# EAGLE design Preliminary Schematic (EAGLE 9.5.1)
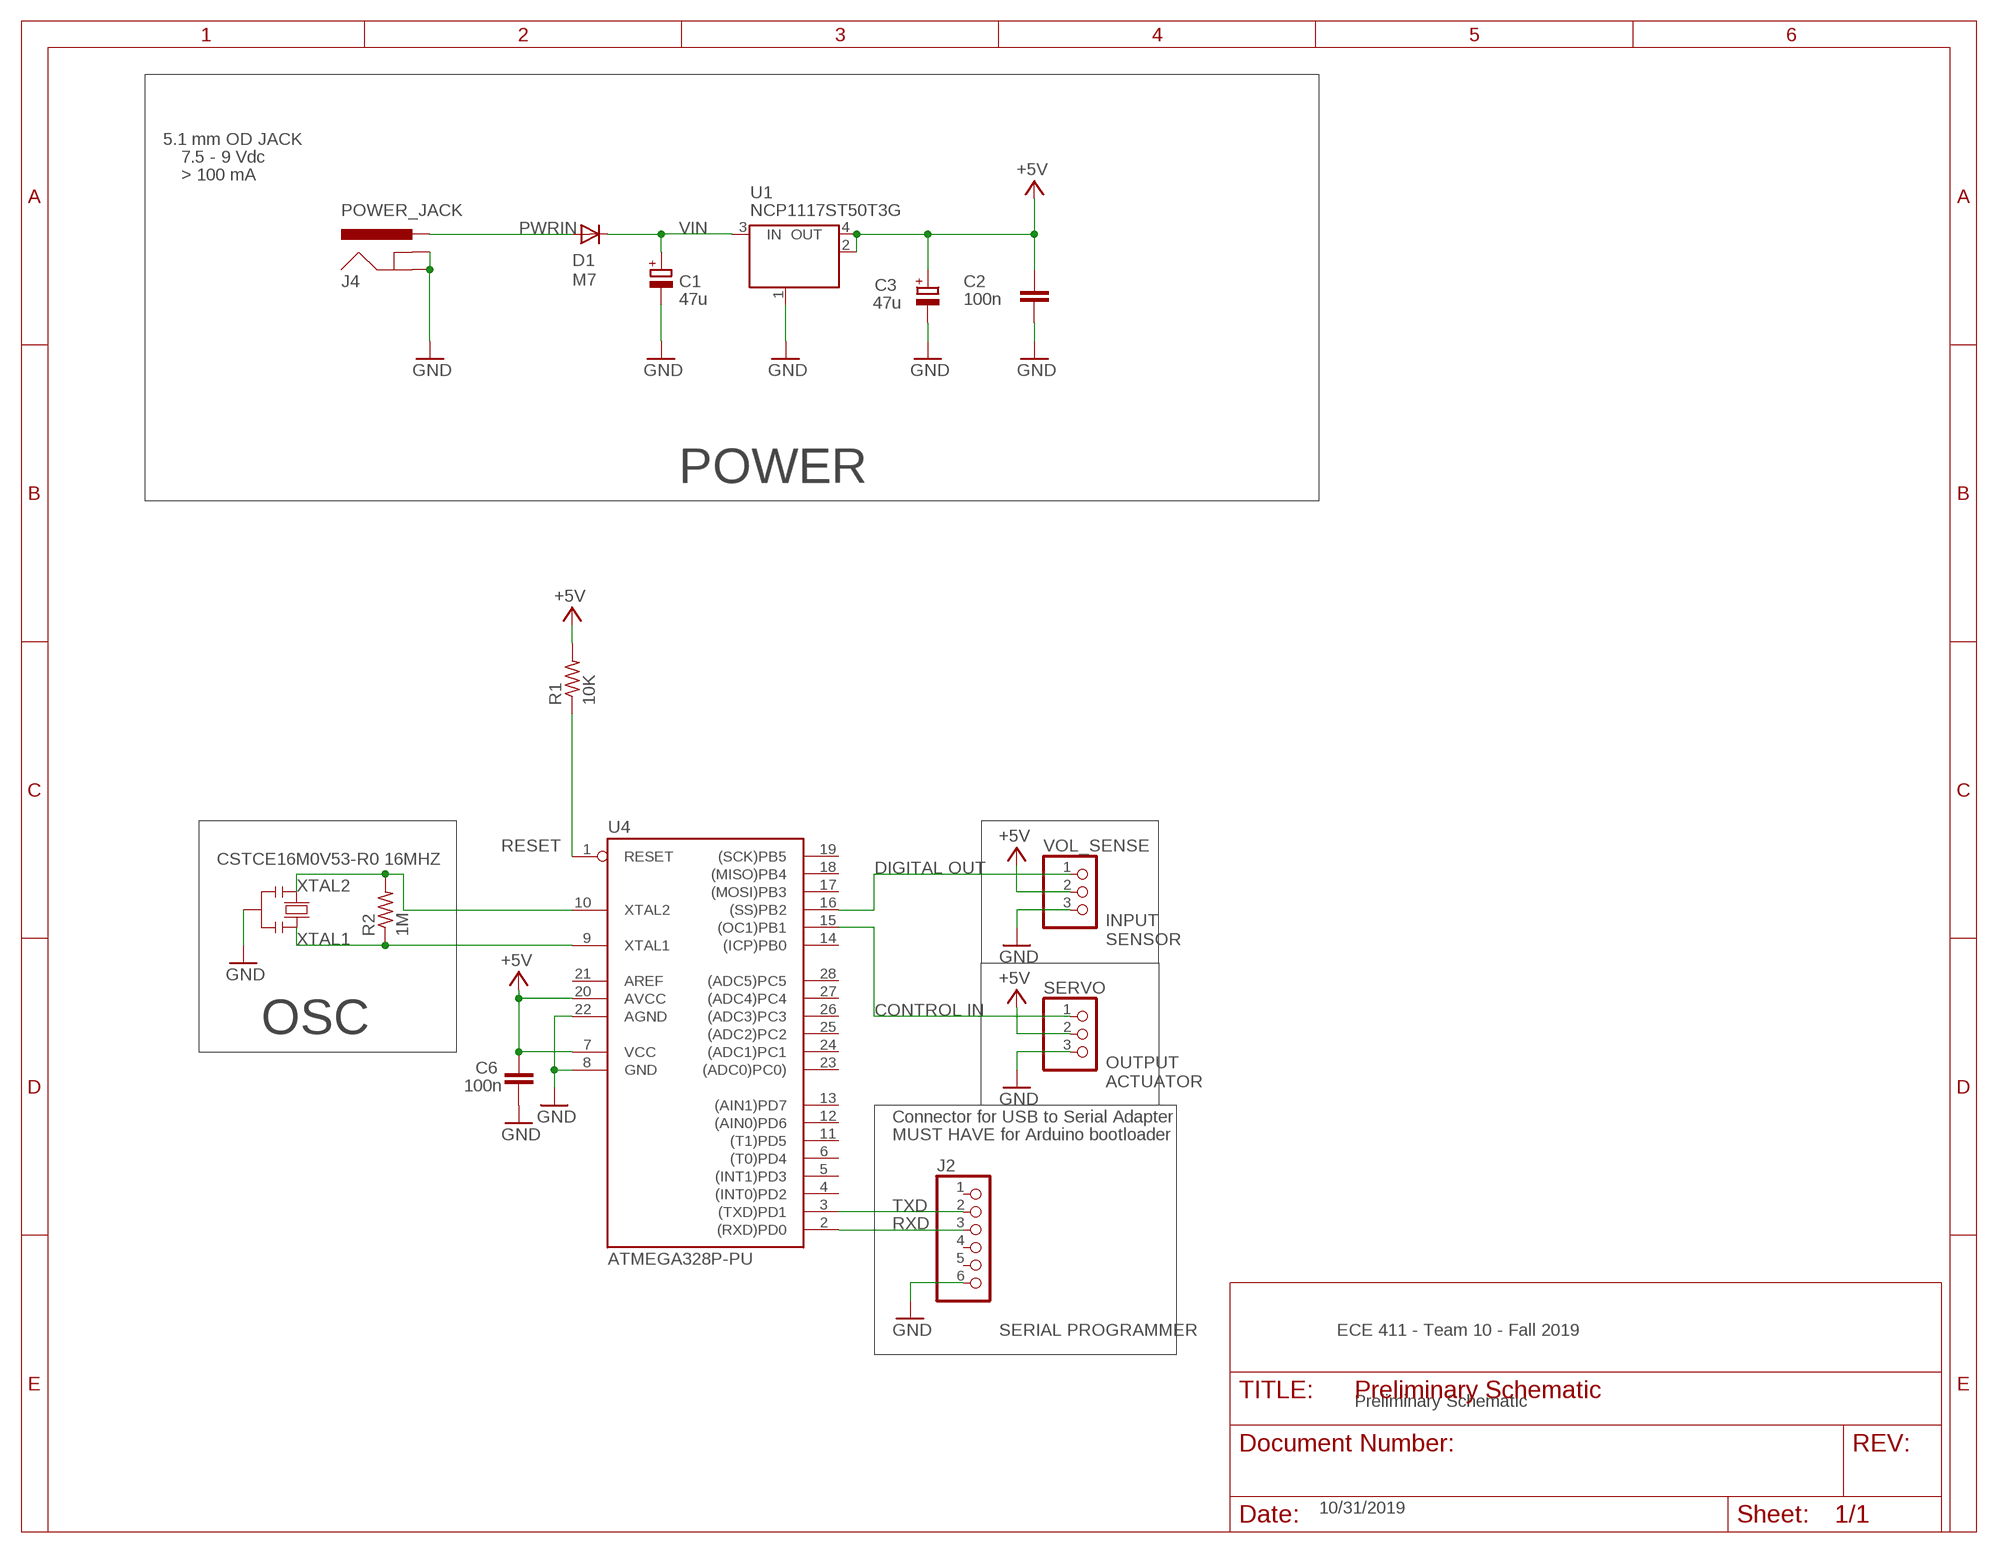
[diagram p0: schematic, sheet 1]

## Parts
C1  47u  CPOL-EUD  [PANASONIC_D]
C2  100n  C-EUC0805  [C0805]
C3  47u  CPOL-EUD  [PANASONIC_D]
C6  100n  C-EUC0805  [C0805]
D1  M7  DIODE-SMB  [SMB]
J2  PINHD-1X6  [1X06]
J4  POWER_JACK  [POWER_JACK_PTH]
R1  10K  R-US_R0805  [R0805]
R2  1M  R-US_R0805  [R0805]
SERVO  PINHD-1X3  [1X03]
U1  NCP1117ST50T3G  MC33269ST-3.3T3  [SOT223]
U4  ATMEGA328P-PU  [DIL28-3]
VOL_SENSE  PINHD-1X3  [1X03]
X1  CSTCE16M0V53-R0 16MHZ  RESONATORMU  [RESONATOR]

## Nets
+5V [usbvcc]: C2.2 C3.+ C6.2 R1.2 SERVO.2 U1.2(OUT) U1.4(OUT) U4.7(VCC) U4.20(AVCC) VOL_SENSE.2
GND [gnd]: C1.- C2.1 C3.- C6.1 J2.6 J4.GND J4.GNDBREAK SERVO.3 U1.1(GND/ADJ) U4.8(GND) U4.22(AGND) VOL_SENSE.3 X1.2
N$2: SERVO.1 U4.15((OC1)PB1)
N$3: U4.16((SS)PB2) VOL_SENSE.1
PWRIN [power]: D1.A J4.PWR
RESET: R1.1 U4.1(RESET)
RXD: J2.3 U4.2((RXD)PD0)
TXD: J2.2 U4.3((TXD)PD1)
VIN [power]: C1.+ D1.C U1.3(IN)
XTAL1: R2.1 U4.9(XTAL1) X1.3
XTAL2: R2.2 U4.10(XTAL2) X1.1
Unconnected: J2.1 J2.4 J2.5 U4.4((INT0)PD2) U4.5((INT1)PD3) U4.6((T0)PD4) U4.11((T1)PD5) U4.12((AIN0)PD6) U4.13((AIN1)PD7) U4.14((ICP)PB0) U4.17((MOSI)PB3) U4.18((MISO)PB4) U4.19((SCK)PB5) U4.21(AREF) U4.23((ADC0)PC0)) U4.24((ADC1)PC1) U4.25((ADC2)PC2) U4.26((ADC3)PC3) U4.27((ADC4)PC4) U4.28((ADC5)PC5)

## Notes on the sheet
- 5.1 mm OD JACK
- 7.5 - 9 Vdc
- > 100 mA
- POWER
- DIGITAL OUT
- INPUT 
  SENSOR
- CONTROL IN
- OSC
- OUTPUT
  ACTUATOR
- Connector for USB to Serial Adapter
- MUST HAVE for Arduino bootloader
- SERIAL PROGRAMMER | ECE 411 - Team 10 - Fall 2019
- Preliminary Schematic
- 10/31/2019

## Library data of the parts
C1 C3 = rcl:CPOL-EU: POLARIZED CAPACITOR, European symbol
C2 C6 = rcl:C-EU: CAPACITOR, European symbol
D1 = diode:DIODE-: DIODE
J2 = pinhead:PINHD-1X6: PIN HEADER
J4 = SparkFun-Connectors:POWER_JACK: Power Jack Connector This is the standard 5.5mm barrel jack for power. The PTH is the most common, proven, reliable, footprint. The Slot footprint only works if the mill layer is transmitted to the PCB fab house so be warned. Here are the connectors we sell at SparkFun: DC Barrel Power Jack/Connector <https://www.sparkfun.com/products/119> (PRT-00119) DC Barrel Power Jack/Connector (SMD) <https://www.sparkfun.com/products/12748> (PRT-12748) DC Barrel Jack Adapter - Breadboard Compatible <https://www.sparkfun.com/products/10811> (PRT-10811) It is used on this SparkFun product (and many, many others): SparkFun RedBoard - Programmed with Arduino <https://www.sparkfun.com/products/12757> (DEV-12757) Also, if you need a mating power supply or connector, please check these out: Wall Adapter Power Supply - 9VDC 650mA <https://www.sparkfun.com/products/298> (TOL-00298) DC Barrel Jack Adapter - Male <https://www.sparkfun.com/products/10287> (PRT-10287); PROD_ID: CONN-08197
R1 R2 = rcl:R-US_: RESISTOR, American symbol
SERVO VOL_SENSE = pinhead:PINHD-1X3: PIN HEADER
U1 = linear:MC33269ST*: Adjustable Output Low Dropout Voltage Regulator 800 mA Source: http://www.onsemi.com/pub/Collateral/MC33269-D.PDF
U4 = SmartPrj:ATMEGA328P-: MICROCONTROLLER 4 Kbytes FLASH 128 bytes SRAM 256 bytes EEPROM UART 6-channel 10 bit ADC
X1 = SmartPrj:RESONATOR

## Net classes
0 default: width 0.254 mm, clearance 0.254 mm
1 power: width 0.61 mm, drill 0.61 mm, clearance 0.254 mm
2 gnd: width 0.305 mm, drill 0.559 mm, clearance 0.254 mm
3 usbvcc: width 0.508 mm, drill 0.61 mm, clearance 0.254 mm
4 aref: width 0.406 mm, drill 0.61 mm, clearance 0.254 mm

## Board
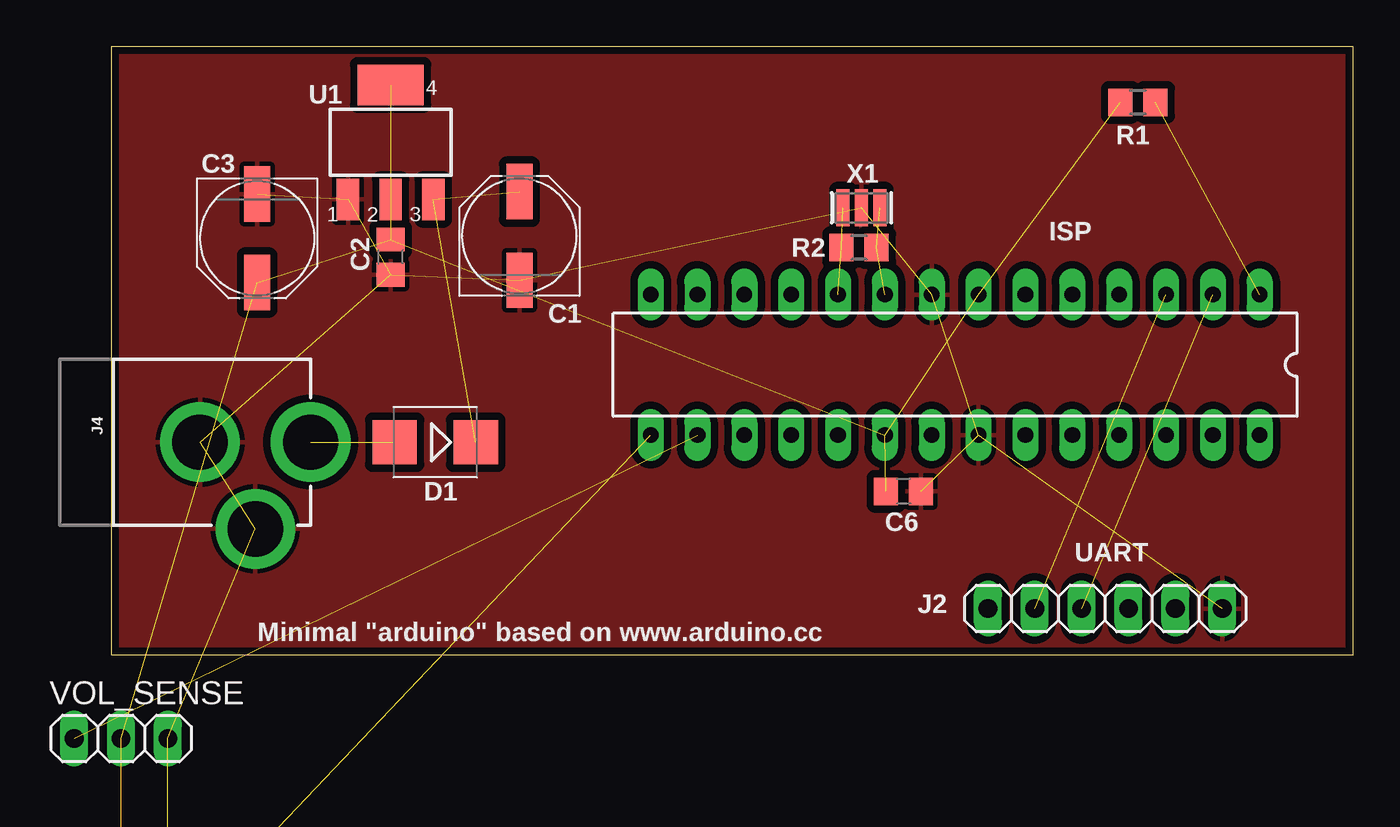
[diagram p1: board, top side]
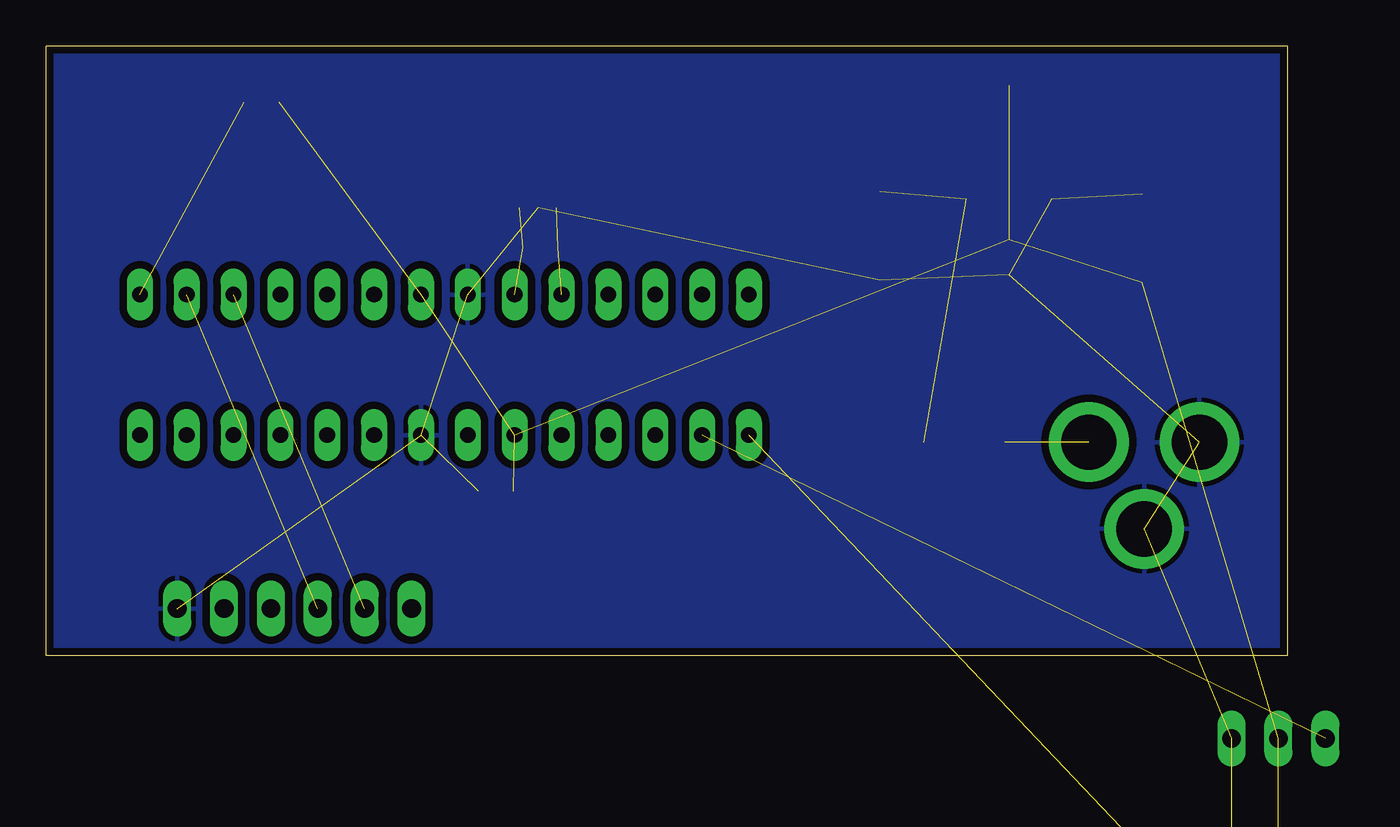
[diagram p2: board, bottom side, seen from below]

Size 67.31 x 33.02 mm. Coordinates in mm from the lower left corner, seen from the top.
Outline: 0,0 0,33.02 67.31,33.02 67.31,0 0,0
Copper layers (1*16): Top 0.035559375mm / dielectric 1.6mm / Bottom 0.035559375mm
Design rules "oshpark-2layer": minimum track width 6mil, minimum drill 10mil, track to track 6mil, track to pad 6mil, pad to pad 6mil, via to via 6mil, smd to smd 6mil, copper to edge 15mil, drill to drill 6mil, minimum pad ring 5mil, minimum via ring 5mil, stop-mask expansion 2.5mil, vias tented up to drill 0mil, thermal gap 10mil

### Footprints (pad centres in the part's own frame; a part is rotated, then mirrored left to right if it is on the bottom)
PANASONIC_D = smd 3 x 1.4: + 2.4,0; - -2.4,0
C0805 = smd 1.3 x 1.5: 1 -0.95,0; 2 0.95,0
SMB = smd 2.4 x 2.4: A 2.2,0; C -2.2,0
1X06 = drill 1.016 long: 1 -6.35,0; 2 -3.81,0; 3 -1.27,0; 4 1.27,0; 5 3.81,0; 6 6.35,0
POWER_JACK_PTH = drill 2.997 pad 4.318: GND 0,7.7; GNDBREAK 4.7,10.7; PWR 0,13.7
R0805 = smd 1.3 x 1.5: 1 -0.95,0; 2 0.95,0
1X03 = drill 1.016 long: 1 -2.54,0; 2 0,0; 3 2.54,0
SOT223 = smd 1.219 x 2.235: 1 -2.311,-3.099; 2 0,-3.099; 3 2.311,-3.099 | smd 3.6 x 2.2: 4 0,3.099
DIL28-3 = drill 0.85 pad 1.422 long: 1 -16.51,-3.81; 2 -13.97,-3.81; 3 -11.43,-3.81; 4 -8.89,-3.81; 5 -6.35,-3.81; 6 -3.81,-3.81; 7 -1.27,-3.81; 8 1.27,-3.81; 9 3.81,-3.81; 10 6.35,-3.81; 11 8.89,-3.81; 12 11.43,-3.81; 13 13.97,-3.81; 14 16.51,-3.81; 15 16.51,3.81; 16 13.97,3.81; 17 11.43,3.81; 18 8.89,3.81; 19 6.35,3.81; 20 3.81,3.81; 21 1.27,3.81; 22 -1.27,3.81; 23 -3.81,3.81; 24 -6.35,3.81; 25 -8.89,3.81; 26 -11.43,3.81; 27 -13.97,3.81; 28 -16.51,3.81
RESONATOR = smd 0.7 x 2: 1 -1,0; 2 0,0; 3 1,0

### Placement (x,y rotation side)
C1  22.1,22.73 90 top
C2  15.11,21.59 90 top
C3  7.87,22.61 270 top
C6  42.93,8.89 180 top
D1  17.53,11.56 180 top
J2  53.85,2.54 0 top
J4  -2.92,11.56 270 top
R1  55.63,29.97 180 top
R2  40.51,22.1 180 top
SERVO  0.5,-21 0 top  (outside the outline)
U1  15.11,27.81 0 top
U4  45.72,15.75 180 top
VOL_SENSE  0.5,-4.5 0 top  (outside the outline)
X1  40.64,24.26 0 top

### Tracks (layer width: path | path; a pad name or v marks a point on that pad's centre or on a via)
+5V  (9 unrouted)
GND  (12 unrouted)
  pour Bottom (isolate 0.406, rank 2): 0,33.02 67.06,33.02 67.31,32.77 67.31,0 0.25,0 0,0.25
  pour Top (isolate 0.406, rank 2): 0,33.02 67.31,33.02 67.31,0 0,0 -0.13,29.84
N$2  (1 unrouted)
N$3  (1 unrouted)
PWRIN  (1 unrouted)
RESET  (1 unrouted)
RXD  (1 unrouted)
TXD  (1 unrouted)
VIN  (2 unrouted)
XTAL1  (2 unrouted)
XTAL2  (2 unrouted)

### Text on the board
tPlace: ISP | UART
tNames: Minimal "arduino" based on www.arduino.cc
214bmp: D:/SmartProjects/Snc/a4_bn_logo2.bmp